# Altium project RF95W.PrjPcb
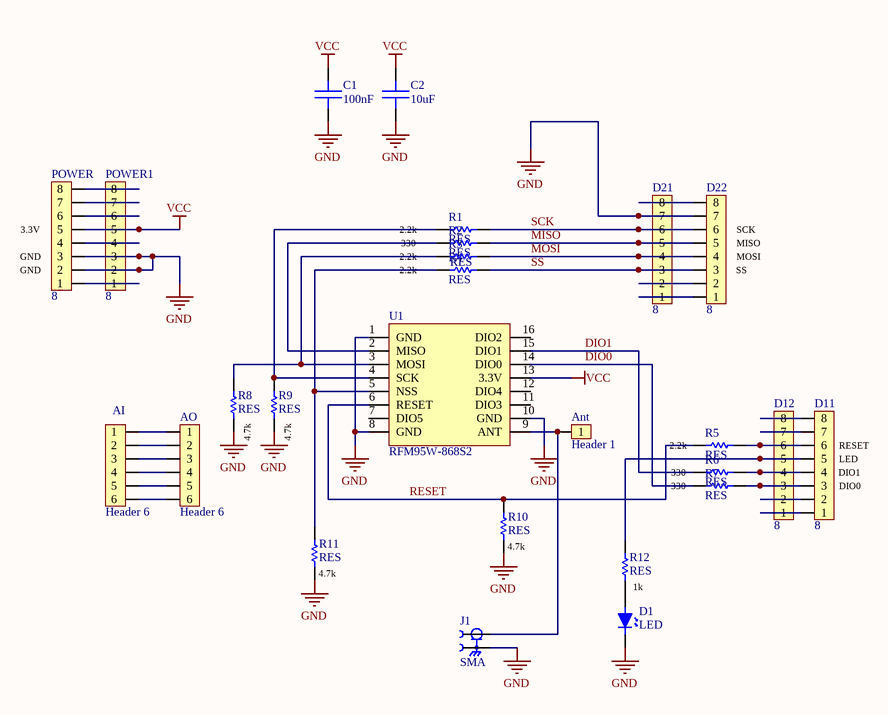
[diagram p0: Sheet1.SchDoc]
1 sheet, 26 parts. Net scope: global (net labels, ports and power ports of the same name join across sheets).
Board file: PCB1.PcbDoc

## Sheet Sheet1.SchDoc: Arduino lora shield
size A4; E-mail: info@ioelectro.ir; Date: *******; ApprovedBy: *******; CheckedBy: None; Author: *******; CompanyName: *******; DrawnBy: Esmaeill M; Engineer: *******; Organization: *******; Address1: *******; Address2: *******; Address3: *******; Address4: *******; DocumentNumber: 1; Revision: *******; SheetNumber: 1; SheetTotal: 1; Address_Website: www.ioelectro.ir; Address_City: Bushehr,Iran; Company: IOElectro; ProjectNumber: 1080; Version: 0.1; CurrentTime: *******; CurrentDate: *******; Time: *******; DocumentFullPathAndName: *******; DocumentName: *******; ModifiedDate: *******; ImagePath: *******; ProjectName: *******; Application_BuildNumber: *******

### Parts
AI  Header 6  [PH-1X6]
Ant  Header 1  [PH-1X1]
AO  Header 6  [PH-1X6]
C1  100nF  [C-0805]
C2  10uF  [C-0805]
D1  LED  [LED-0805]
D11  8  [PH-1X8]
D12  8  [PH-1X8]
D21  8  [PH-1X8]
D22  8  [PH-1X8]
J1  SMA  [SMA-CONNECTOR-R]
POWER  8  [PH-1X8]
POWER1  8  [PH-1X8]
R1  RES  [R-0805]
R2  RES  [R-0805]
R3  RES  [R-0805]
R4  RES  [R-0805]
R5  RES  [R-0805]
R6  RES  [R-0805]
R7  RES  [R-0805]
R8  RES  [R-0805]
R9  RES  [R-0805]
R10  RES  [R-0805]
R11  RES  [R-0805]
R12  RES  [R-0805]
U1  RFM95W-868S2  [RFM95]

### Nets
GND: C1.2 C2.2 D1.K D21.7 D22.7 J1.2 POWER.2 POWER.3 POWER1.2 POWER1.3 R8.1 R9.1 R10.1 R11.1 U1.1(GND) U1.8(GND) U1.10(GND)
VCC: C1.1 C2.1 POWER.5 POWER1.5 U1.13(3.3V)
DIO0: R7.1 U1.14(DIO0)
DIO1: R6.1 U1.15(DIO1)
MISO: D21.5 D22.5 R2.2
MOSI: D21.4 D22.4 R3.2
RESET: R5.1 R10.2 U1.6(RESET)
SCK: D21.6 D22.6 R1.2
SS: D21.3 D22.3 R4.2
NetAI_1: AI.1 AO.1
NetAI_2: AI.2 AO.2
NetAI_3: AI.3 AO.3
NetAI_4: AI.4 AO.4
NetAI_5: AI.5 AO.5
NetAI_6: AI.6 AO.6
NetAnt_1: Ant.1 J1.1 U1.9(ANT)
NetD1_A: D1.A R12.1
NetD11_1: D11.1 D12.1
NetD11_2: D11.2 D12.2
NetD11_3: D11.3 D12.3 R7.2
NetD11_4: D11.4 D12.4 R6.2
NetD11_5: D11.5 D12.5 R12.2
NetD11_6: D11.6 D12.6 R5.2
NetD11_7: D11.7 D12.7
NetD11_8: D11.8 D12.8
NetD21_1: D21.1 D22.1
NetD21_2: D21.2 D22.2
NetD21_8: D21.8 D22.8
NetPOWER_1: POWER.1 POWER1.1
NetPOWER_4: POWER.4 POWER1.4
NetPOWER_6: POWER.6 POWER1.6
NetPOWER_7: POWER.7 POWER1.7
NetPOWER_8: POWER.8 POWER1.8
NetR1_1: R1.1 R9.2 U1.4(SCK)
NetR2_1: R2.1 U1.2(MISO)
NetR3_1: R3.1 R8.2 U1.3(MOSI)
NetR4_1: R4.1 R11.2 U1.5(NSS)

Not connected (* = marked no-connect by the designer): U1 7(DIO5) 11(DIO3) 12(DIO4) 16(DIO2)

### Notes on the sheet
- (near POWER) 3.3V
- (near POWER) GND
- 2.2k
- 330
- (near D22) SS
- (near D22) SCK
- (near D22) MISO
- (near D22) MOSI
- (near R8) 4.7k
- (near R9) 4.7k
- (near D11) LED
- (near D11) DIO1
- (near D11) RESET
- (near R10) 4.7k
- (near D11) DIO0
- (near R11) 4.7k
- (near R12) 1k
- Title:
- Size:
- Date:
- A4
- Project Number:
- Time:
- Revision:
- Sheet
- of
- Drawn By:
- IOElectro
- File:
- Note:

### Library data of the parts
AI AO = PH-1X6: PIN HEADER 1x6 2.56mm
Ant = PH-1X1: PIN HEADER 1x1 2.56mm
C1 C2 = CAP: CAPACITOR BIPOLAR
D11 D12 D21 D22 POWER POWER1 = PH-1X8: PIN HEADER 1x8 2.56mm
J1 = SMA-CONNECTOR: Straight SMA Connector; MP: altium_native_batch; Value: *; Package: None; Availability: Unavailable; Price: None
U1 = RFM95W-868S2: Transceiver RF 868 MHz (+20/-139dBm), FSK, GFSK, MSK, GMSK, LoRaTM, OOK, 16 x 16 mm; Manufacturer: RF Solutions; Interface: SPI; Frequency: 868MHz; Data Rate: 300Kbps; Sensitivity: -123dBm; Current - Receiving: 12.1mA; Current - Transmitting: 120mA; Supplier 1: Mouser; Manufacturer Part Number: RFM95W-868S2; RoHS: Yes; Category: RF Receivers, Transceivers; Stock 1: 200; Pricing 1: 1=22/49, 10=20/77, 50=18/46, 100=17/59, 1000=15/57, 10000=15/57 (USD); Mount: Surface Mount; Case/Package: SMD/SMT; Min Operating Temperature: -20°C; Max Operating Temperature: 70°C; Packaging: Bulk; ComponentLink1URL: https://www.rfsolutions.co.uk/downloads/1463993415RFM95_96_97_98W.pdf?src-supplier=Digikey; ComponentLink1Description: https://www.rfsolutions.co.uk/downloads/1463993415RFM95_96_97_98W.pdf?src-supplier=Digikey; Supplier Part Number 1: 223-RFM95W-868S2